# Altium project 2ban_PCB_Project.PrjPcb
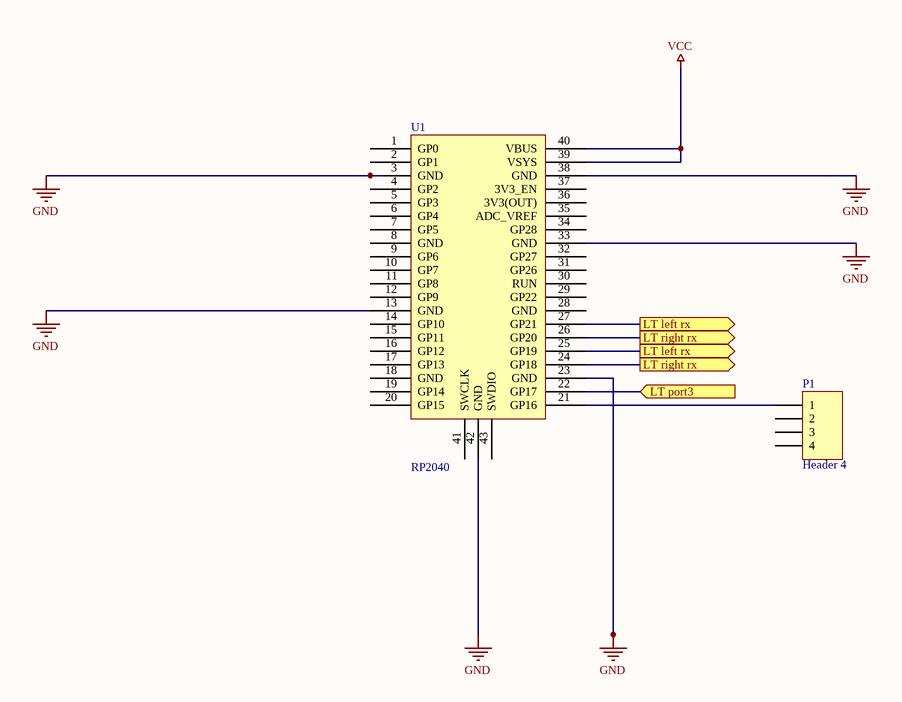
[diagram p0: MCU.SchDoc]
3 sheets, 19 parts. Net scope: flat (ports and power ports of the same name join across sheets).
Board files: PCB1.PcbDoc, PICO_PCB_2ban.PcbDoc
Sheets:
  MCU.SchDoc
  pico_2ban.SchDoc
  LM324.SchDoc

## Sheet MCU.SchDoc
size A3; SheetNumber: 1; SheetTotal: 3

### Parts
P1  Header 4  [HDR1X4]
U1  RP2040  [PCBComponent_1]

### Ports
LT left rx (out), LT port3 (in), LT right rx (out)

### Nets
GND: U1.3(GND) U1.13(GND) U1.23(GND) U1.33(GND) U1.38(GND) U1.42(GND)
VCC: U1.39(VSYS) U1.40(VBUS)
LT left rx: U1.25(GP19) U1.27(GP21) ; port LT left rx
LT port3: U1.22(GP17) ; port LT port3
LT right rx: U1.24(GP18) U1.26(GP20) ; port LT right rx
NetP1_1: P1.1 U1.21(GP16)

Not connected (* = marked no-connect by the designer): P1 2 3 4; U1 1(GP0) 2(GP1) 4(GP2) 5(GP3) 6(GP4) 7(GP5) 8(GND) 9(GP6) 10(GP7) 11(GP8) 12(GP9) 14(GP10) 15(GP11) 16(GP12) 17(GP13) 18(GND) 19(GP14) 20(GP15) 28(GND) 29(GP22) 30(RUN) 31(GP26) 32(GP27) 34(GP28) 35(ADC_VREF) 36(3V3(OUT)) 37(3V3_EN) 41(SWCLK) 43(SWDIO)

### Library data of the parts
P1 = Header 4: Header, 4-Pin; LatestRevisionDate: 17-Jul-2002; LatestRevisionNote: Re-released for DXP Platform.; Publisher: Altium Limited
U1 = Component_1

## Sheet pico_2ban.SchDoc
size A3; SheetNumber: 1; SheetTotal: 1

## Sheet LM324.SchDoc
size A4; SheetNumber: 3; SheetTotal: 3
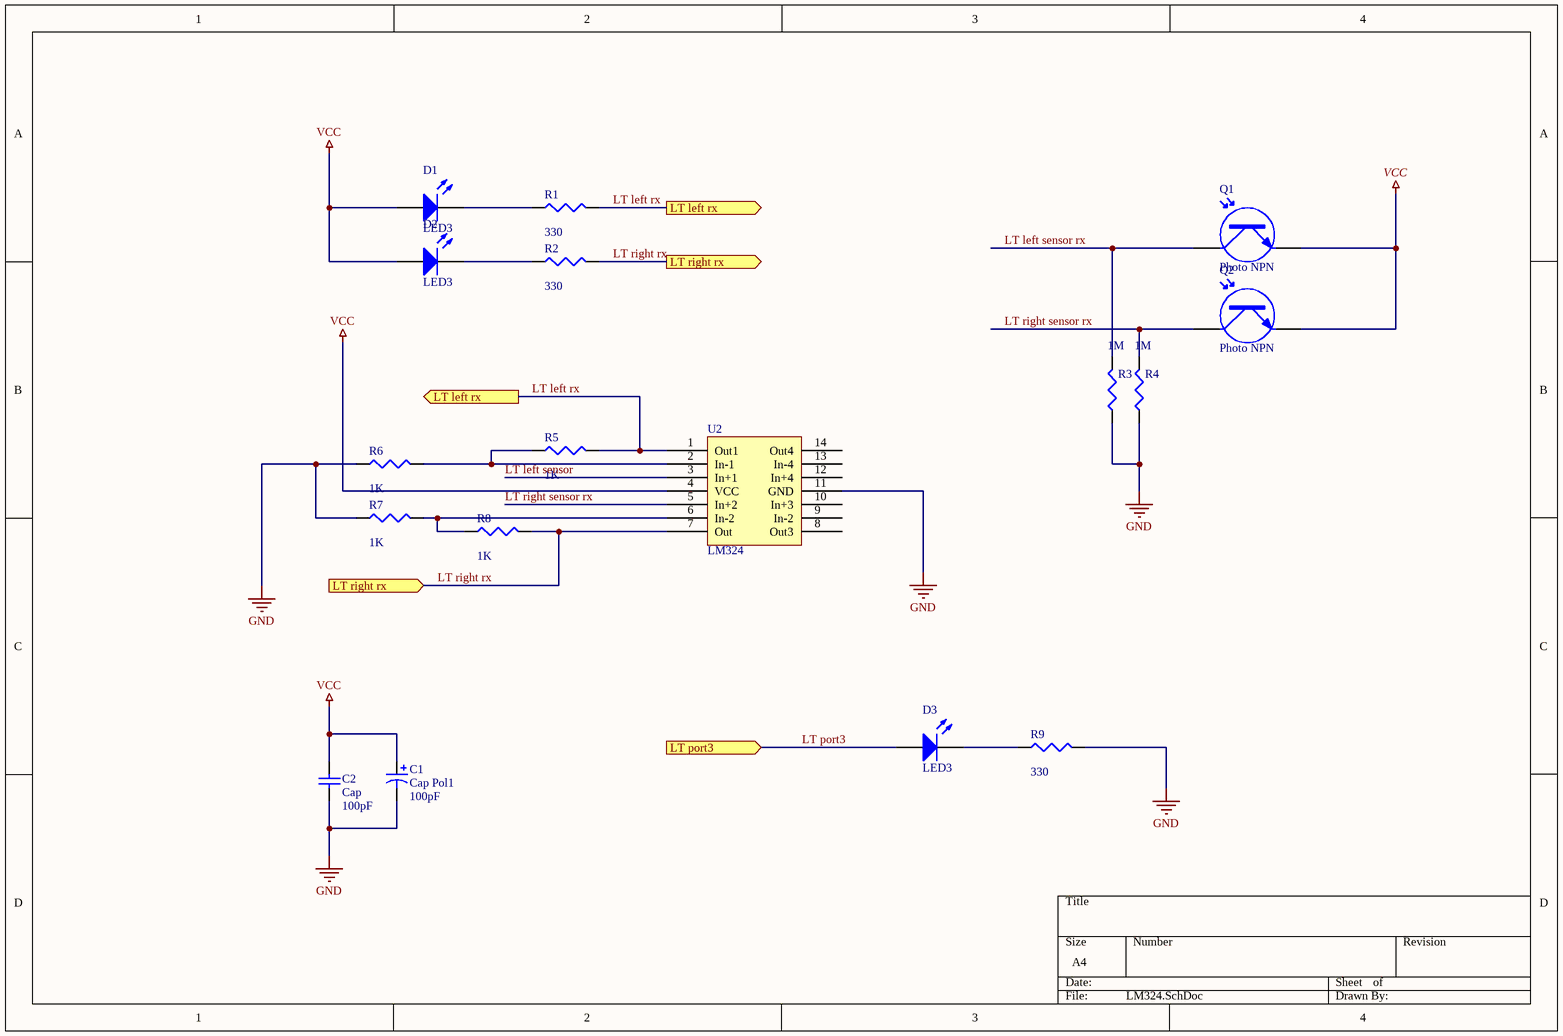
[diagram p1: LM324.SchDoc]

### Parts
C1  Cap Pol1  value 100pF  [RB7.6-15]
C2  Cap  value 100pF  [RAD-0.3]
D1  LED3  [3.5X2.8X1.9]
D2  LED3  [3.5X2.8X1.9]
D3  LED3  [3.5X2.8X1.9]
Q1  Photo NPN  [TO-220_A]
Q2  Photo NPN  [TO-220_A]
R1  value 330  [J1-0603]  (hidden comment: Res3)
R2  value 330  [J1-0603]  (hidden comment: Res3)
R3  value 1M  [J1-0603]  (hidden comment: Res3)
R4  value 1M  [J1-0603]  (hidden comment: Res3)
R5  value 1K  [J1-0603]  (hidden comment: Res3)
R6  value 1K  [J1-0603]  (hidden comment: Res3)
R7  value 1K  [J1-0603]  (hidden comment: Res3)
R8  value 1K  [J1-0603]  (hidden comment: Res3)
R9  value 330  [J1-0603]  (hidden comment: Res3)
U2  LM324  [SOT27-1]

### Ports
LT left rx (out), LT port3 (in), LT right rx (in), LT right rx (out)

### Nets
GND: C1.2 C2.1 R3.1 R4.1 R6.1 R7.1 R9.2 U2.11(GND)
VCC: C1.1 C2.2 D1.1(A) D2.1(A) Q1.3(E) Q2.3(E) U2.4(VCC)
LT left rx: R1.2 R5.2 U2.1(Out1) ; port LT left rx
LT left sensor: U2.3(In+1)
LT left sensor rx: Q1.1(C) R3.2
LT port3: D3.1(A) ; port LT port3
LT right rx: R2.2 R8.2 U2.7(Out) ; port LT right rx
LT right sensor rx: Q2.1(C) R4.2 U2.5(In+2)
NetD1_2: D1.2(K) R1.1
NetD2_2: D2.2(K) R2.1
NetD3_2: D3.2(K) R9.1
NetR5_1: R5.1 R6.2 U2.2(In-1)
NetR7_2: R7.2 R8.1 U2.6(In-2)

Not connected (* = marked no-connect by the designer): U2 8(Out3) 9(In-2) 10(In+3) 12(In+4) 13(In-4) 14(Out4)

### Library data of the parts
C1 = Cap Pol1: Polarized Capacitor (Radial); Published: 8-Jun-2000; LatestRevisionDate: 17-Jul-2002; LatestRevisionNote: Re-released for DXP Platform.; PackageReference: RB7.6-15; Publisher: Altium Limited; PackageDescription: Polarized Capacitor (Radial); 2 Leads
C2 = Cap: Capacitor; Published: 8-Jun-2000; LatestRevisionDate: 17-Jul-2002; LatestRevisionNote: Re-released for DXP Platform.; PackageReference: RAD-0.3; Publisher: Altium Limited; PackageDescription: Radial Cap, Thru-Hole; 2 Leads; 0.3 in Pin Spacing
D1-D3 = LED3: Typical BLUE SiC LED; Published: 8-Jun-2000; LatestRevisionDate: 17-Dec-2003; LatestRevisionNote: PCB Footprint replaced.; DatasheetVersion: 16-Apr-2002; PackageVersion: 16-Apr-2002; PackageReference: 3.5X2.8X1.9; Publisher: Altium Limited; PackageDescription: SM LED; 2 C-Bend Leads; Body 3.5 x 2.8 x 1.9 mm, inc leads (LxWxH typ)
Q1 Q2 = Photo NPN: NPN Phototransistor; Published: 24-Mar-1999; LatestRevisionDate: 17-Jul-2002; LatestRevisionNote: Re-released for DXP Platform.; PackageReference: TO-220_A; Publisher: Altium Limited; Code_JEDEC: TO-220-AC
R1-R9 = Res3: Resistor; Published: 8-Jun-2000; LatestRevisionDate: 29-May-2009; LatestRevisionNote: IPC-7351 Footprint Added.; PackageReference: J1-0603; Publisher: Altium Limited; PackageDescription: Chip Resistor
  R1: Parameter 1: *

## Nets that join several sheets
GND: MCU (6 pins), LM324 (8 pins)
VCC: MCU (U1.39 U1.40), LM324 (7 pins)
LT left rx: MCU (U1.25 U1.27), LM324 (R1.2 R5.2 U2.1)
LT port3: MCU (U1.22), LM324 (D3.1)
LT right rx: MCU (U1.24 U1.26), LM324 (R2.2 R8.2 U2.7)